# Altium schematic sheet 4_wiring drawing.SchDoc: DUT POWER ON/OFF CONTROL
size A2; ApprovedBy: Approved By; CheckedBy: Sky Ma; DrawnBy: Jack; Address1: 1; Address2: 2; Address3: 3; Address4: 4; DocumentNumber: 04-TE-42-4015-0PA-A; Revision: A; SheetNumber: 5; SheetTotal: 6; SheetSize: A2; CheckedByDate: 2022-11-19; DrawByDate: 2022-11-19; SiteName: EMS TD Huangpu; ProjectName: 19205_BMW CCU DDR PCBA FT fixture wiring
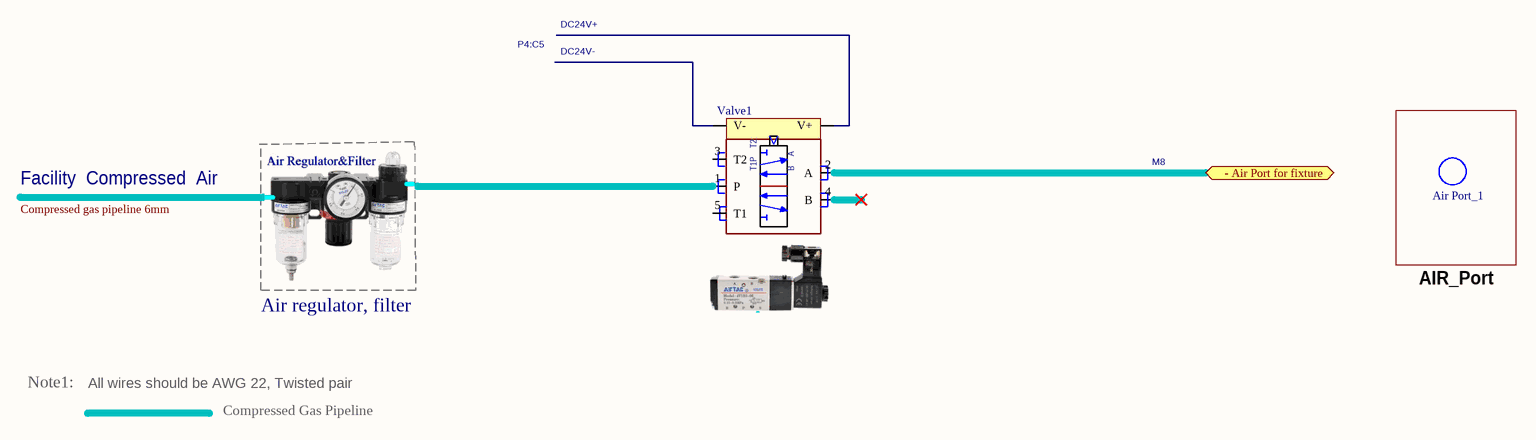
[diagram p0: 4_wiring drawing.SchDoc]

## Parts
Valve1  SMC SY5120-5LZD-01  (value not drawn)

## Ports
- Air Port for fixture

## Nets

Not connected (* = marked no-connect by the designer): Valve1 0(V+) 1(V-) 2(A) 3(T2) 4(B) 5(T1)

## Notes on the sheet
- P4:C5
- DC24V-
- DC24V+
- Facility  Compressed  Air
- M8
- Air Port_1
- AIR_Port
- Air regulator, filter
- Note1:
- All wires should be AWG 22, Twisted pair
- Compressed Gas Pipeline
- Labels drawn without touching a wire or pin: Compressed gas pipeline 6mm
- Document Number:
- Rev:
- Project Name:
- Drawn By:
- Date:
- Titile:
- Checked By:
- Sheet:
- Of

## Library data of the parts
Valve1 = Valve1